# Altium schematic sheet power.SchDoc
size A3; DocumentNumber: 2; Revision: V1.0; SheetNumber: 2; SheetTotal: 9
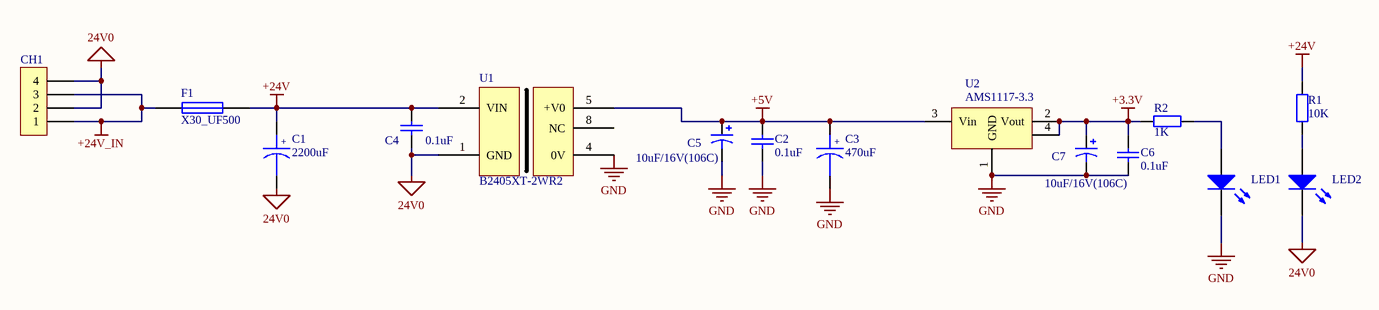
[diagram p0: power.SchDoc]

## Parts
C1  C_2200uF  [C7.8*17]  (value not drawn)
C2  value 0.1uF  [0805]  (hidden comment: Cap)
C3  C_2200uF  [C5*10]  (value not drawn)
C4  value 0.1uF  [0805]  (hidden comment: Cap)
C5  value 10uF/16V(106C)  [CAP A-3216]  (hidden comment: Cap Pol3)
C6  value 0.1uF  [0805]  (hidden comment: Cap)
C7  value 10uF/16V(106C)  [CAP A-3216]  (hidden comment: Cap Pol3)
CH1  HEADER1X4  [CH3.96-4PIN]  (value not drawn)
F1  X30_UF500  [X30UF600]
LED1  (no value)  [LED-0805]
LED2  (no value)  [LED-0805]
R1  value 10K  [0805]  (hidden comment: Res2)
R2  value 1K  [0805]  (hidden comment: Res2)
U1  B2405XT-2WR2  [B2405XT-2WR2]
U2  AMS1117-3.3  [SOT223]

## Nets
24V0: C1.2 C4.1 CH1.2 CH1.4 LED2.2(K) U1.1(GND)
+3.3V: C6.2 C7.1 R2.2 U2.2(Vout) U2.4
+5V: C2.2 C3.1 C5.1 U1.5(+V0) U2.3(Vin)
+24V: C1.1 C4.2 F1.2 R1.2 U1.2(VIN)
+24V_IN: CH1.1 CH1.3 F1.1
GND: C2.1 C3.2 C5.2 C6.1 C7.2 LED1.2(K) U1.4(0V) U2.1(GND)
NetLED1_1: LED1.1(A) R2.1
NetLED2_1: LED2.1(A) R1.1

Not connected (* = marked no-connect by the designer): U1 8(NC)

## Notes on the sheet
- :
- (in symbol C_2200uF) +; 2200uF; 470uF

## Library data of the parts
C2 C4 C6 = Cap: Capacitor; Published: 8-Jun-2000; LatestRevisionDate: 17-Jul-2002; LatestRevisionNote: Re-released for DXP Platform.; PackageReference: RAD-0.3; Publisher: Altium Limited
C5 C7 = Cap Pol3: Polarized Capacitor (Surface Mount); Published: 8-Jun-2000; LatestRevisionDate: 17-Jul-2002; LatestRevisionNote: Re-released for DXP Platform.; PackageReference: C0805; Publisher: Altium Limited
F1 = Fuse 1: Fuse; Published: 8-Jun-2000; LatestRevisionDate: 17-Jul-2002; LatestRevisionNote: Re-released for DXP Platform.; PackageReference: PIN-W2/E2.8; Publisher: Altium Limited
LED1 LED2 = LED2: Typical RED, GREEN, YELLOW, AMBER GaAs LED; Published: 8-Jun-2000; LatestRevisionDate: 17-Jul-2002; LatestRevisionNote: Re-released for DXP Platform.; PackageDocument: Feb-2002; PackageReference: 3.2X1.6X1.1; Publisher: Altium Limited
R1 R2 = Res2: Resistor; Published: 8-Jun-2000; LatestRevisionDate: 17-Jul-2002; LatestRevisionNote: Re-released for DXP Platform.; PackageReference: AXIAL-0.4; Publisher: Altium Limited
U2 = AMS1117-5